# EAGLE schematic t1 (EAGLE 7.5.2)
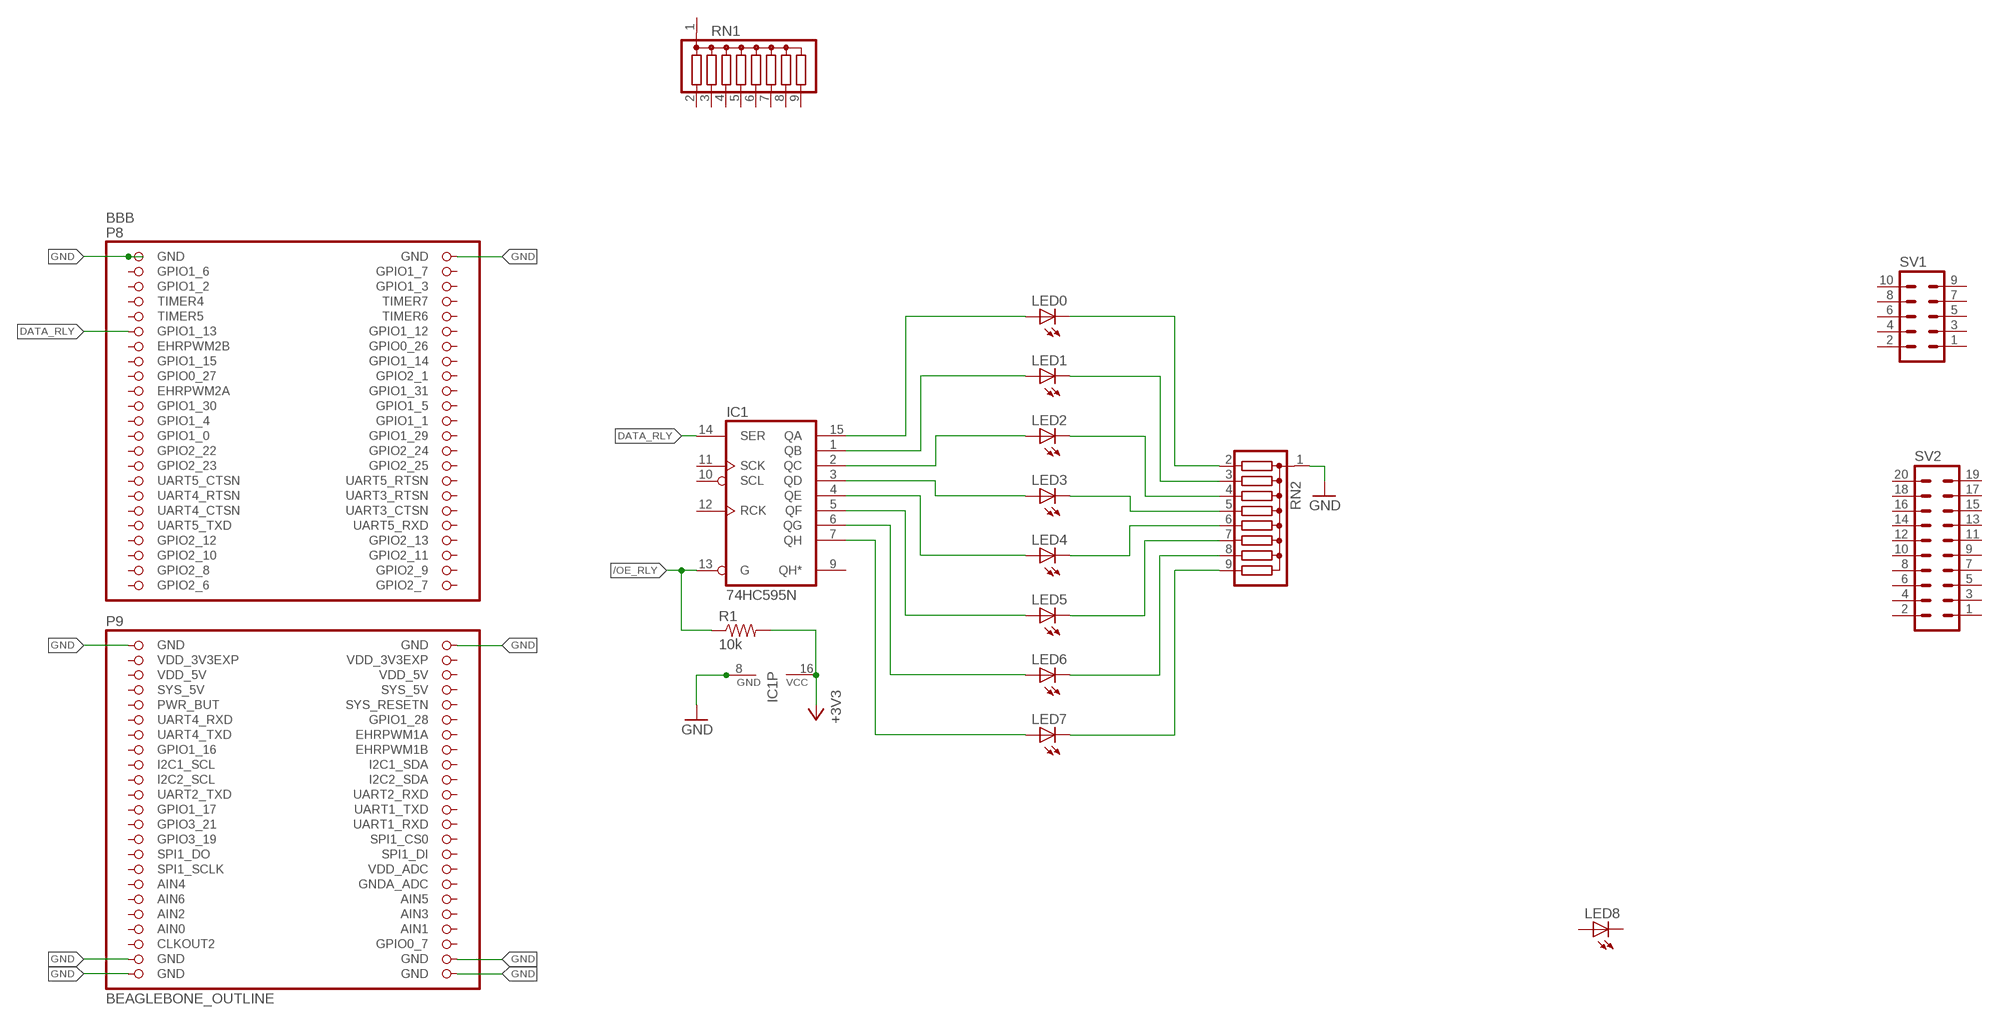
[diagram p0: schematic, sheet 1]

## Parts
BBB  BEAGLEBONE_OUTLINE  [BEAGLEBONE_SHIELD]
IC1  74HC595N  [DIL16]
LED0  LED3MM  [LED3MM]
LED1  LED3MM  [LED3MM]
LED2  LED3MM  [LED3MM]
LED3  LED3MM  [LED3MM]
LED4  LED3MM  [LED3MM]
LED5  LED3MM  [LED3MM]
LED6  LED3MM  [LED3MM]
LED7  LED3MM  [LED3MM]
LED8  LED3MM  [LED3MM]
R1  10k  R-US_0207/12  [0207/12]
RN1  G08R  [SIL9]
RN2  G08R  [SIL9]
SV1  MA05-2  [MA05-2]
SV2  MA10-2  [MA10-2]

## Nets
+3V3: IC1.16(VCC) R1.2
/OE_RLY: IC1.13(G) R1.1
DATA_RLY: BBB.11(GPIO1_13) IC1.14(SER)
GND: BBB.1(GND) BBB.2(GND) BBB.47(GND) BBB.48(GND) BBB.89(GND) BBB.90(GND) BBB.91(GND) BBB.92(GND) IC1.8(GND) RN2.1
N$1: LED7.K(C) RN2.9
N$2: LED1.K(C) RN2.3
N$3: LED3.K(C) RN2.5
N$4: LED2.K(C) RN2.4
N$5: LED4.K(C) RN2.6
N$6: LED6.K(C) RN2.8
N$7: LED0.K(C) RN2.2
N$8: IC1.15(QA) LED0.A
N$9: IC1.1(QB) LED1.A
N$10: LED5.K(C) RN2.7
N$11: IC1.2(QC) LED2.A
N$12: IC1.3(QD) LED3.A
N$13: IC1.4(QE) LED4.A
N$14: IC1.5(QF) LED5.A
N$16: IC1.6(QG) LED6.A
N$17: IC1.7(QH) LED7.A
Unconnected: BBB.3(GPIO1_6) BBB.4(GPIO1_7) BBB.5(GPIO1_2) BBB.6(GPIO1_3) BBB.7(TIMER4) BBB.8(TIMER7) BBB.9(TIMER5) BBB.10(TIMER6) BBB.12(GPIO1_12) BBB.13(EHRPWM2B) BBB.14(GPIO0_26) BBB.15(GPIO1_15) BBB.16(GPIO1_14) BBB.17(GPIO0_27) BBB.18(GPIO2_1) BBB.19(EHRPWM2A) BBB.20(GPIO1_31) BBB.21(GPIO1_30) BBB.22(GPIO1_5) BBB.23(GPIO1_4) BBB.24(GPIO1_1) BBB.25(GPIO1_0) BBB.26(GPIO1_29) BBB.27(GPIO2_22) BBB.28(GPIO2_24) BBB.29(GPIO2_23) BBB.30(GPIO2_25) BBB.31(UART5_CTSN) BBB.32(UART5_RTSN) BBB.33(UART4_RTSN) BBB.34(UART3_RTSN) BBB.35(UART4_CTSN) BBB.36(UART3_CTSN) BBB.37(UART5_TXD) BBB.38(UART5_RXD) BBB.39(GPIO2_12) BBB.40(GPIO2_13) BBB.41(GPIO2_10) BBB.42(GPIO2_11) BBB.43(GPIO2_8) BBB.44(GPIO2_9) BBB.45(GPIO2_6) BBB.46(GPIO2_7) BBB.54(SYS_5V) BBB.55(PWR_BUT) BBB.56(SYS_RESETN) BBB.57(UART4_RXD) BBB.58(GPIO1_28) BBB.59(UART4_TXD) BBB.60(EHRPWM1A) BBB.61(GPIO1_16) BBB.62(EHRPWM1B) BBB.63(I2C1_SCL) BBB.64(I2C1_SDA) BBB.65(I2C2_SCL) BBB.66(I2C2_SDA) BBB.67(UART2_TXD) BBB.68(UART2_RXD) BBB.69(GPIO1_17) BBB.70(UART1_TXD) BBB.71(GPIO3_21) BBB.72(UART1_RXD) BBB.73(GPIO3_19) BBB.74(SPI1_CS0) BBB.75(SPI1_DO) BBB.76(SPI1_DI) BBB.77(SPI1_SCLK) BBB.78(VDD_ADC) BBB.79(AIN4) BBB.80(GNDA_ADC) BBB.81(AIN6) BBB.82(AIN5) BBB.83(AIN2) BBB.84(AIN3) BBB.86(AIN1) BBB.87(CLKOUT2) BBB.88(GPIO0_7) IC1.9(QH*) IC1.10(SCL) IC1.11(SCK) IC1.12(RCK) LED8.A LED8.K(C) RN1.1 RN1.2 RN1.3 RN1.4 RN1.5 RN1.6 RN1.7 RN1.8 RN1.9 SV1.1 SV1.2 SV1.3 SV1.4 SV1.5 SV1.6 SV1.7 SV1.8 SV1.9 SV1.10 SV2.1 SV2.2 SV2.3 SV2.4 SV2.5 SV2.6 SV2.7 SV2.8 SV2.9 SV2.10 SV2.11 SV2.12 SV2.13 SV2.14 SV2.15 SV2.16 SV2.17 SV2.18 SV2.19 SV2.20

## Power pins joined to a net without a drawn wire
AIN0: BBB.85(AIN0)
SYS_5V: BBB.53(SYS_5V)
VDD_3V3EXP: BBB.49(VDD_3V3EXP) BBB.50(VDD_3V3EXP)
VDD_5V: BBB.51(VDD_5V) BBB.52(VDD_5V)

## Library data of the parts
BBB = local:BEAGLEBONE_OUTLINE: Should match A3 pinout - but not completely tested
IC1 = 74xx-eu:74*595: 8-bit SHIFT REGISTER, output latch
LED0 LED1-LED8 = adafruit:LED: LED OSRAM: - CHIPLED LG R971, LG N971, LY N971, LG Q971, LY Q971, LO R971, LY R971 LH N974, LH R974 LS Q976, LO Q976, LY Q976 LO Q996 - Hyper CHIPLED LW Q18S LB Q993, LB Q99A, LB R99A - SideLED LS A670, LO A670, LY A670, LG A670, LP A670 LB A673, LV A673, LT A673, LW A673 LH A674 LY A675 LS A676, LA A676, LO A676, LY A676, LW A676 LS A679, LY A679, LG A679 - Hyper Micro SIDELED® LS Y876, LA Y876, LO Y876, LY Y876 LT Y87S - SmartLED LW L88C, LW L88S LB L89C, LB L89S, LG L890 LS L89K, LO L89K, LY L89K LS L896, LA L896, LO L896, LY L896 - TOPLED LS T670, LO T670, LY T670, LG T670, LP T670 LSG T670, LSP T670, LSY T670, LOP T670, LYG T670 LG T671, LOG T671, LSG T671 LB T673, LV T673, LT T673, LW T673 LH T674 LS T676, LA T676, LO T676, LY T676, LB T676, LH T676, LSB T676, LW T676 LB T67C, LV T67C, LT T67C, LS T67K, LO T67K, LY T67K, LW E67C LS E67B, LA E67B, LO E67B, LY E67B, LB E67C, LV E67C, LT E67C LW T67C LS T679, LY T679, LG T679 LS T770, LO T770, LY T770, LG T770, LP T770 LB T773, LV T773, LT T773, LW T773 LH T774 LS E675, LA E675, LY E675, LS T675 LS T776, LA T776, LO T776, LY T776, LB T776 LHGB T686 LT T68C, LB T68C - Hyper Mini TOPLED® LB M676 - Mini TOPLED Santana® LG M470 LS M47K, LO M47K, LY M47K Source: http://www.osram.convergy.de/
R1 = rcl:R-US_: RESISTOR, American symbol
RN1 RN2 = resistor-sil:G08R: SIL RESISTOR; OC_FARNELL: unknown; OC_NEWARK: unknown
SV1 = con-lstb:MA05-2: PIN HEADER; OC_FARNELL: unknown; OC_NEWARK: unknown
SV2 = con-lstb:MA10-2: PIN HEADER; OC_FARNELL: unknown; OC_NEWARK: unknown